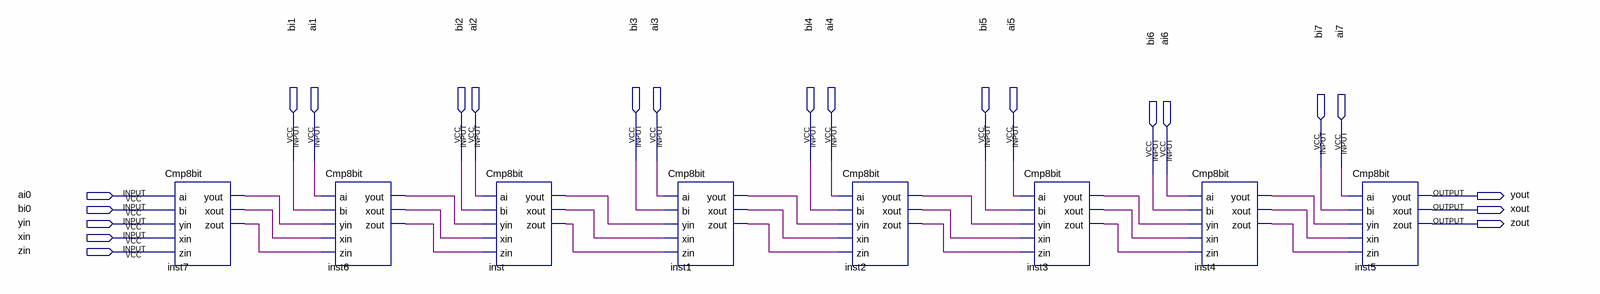
[diagram p0: schematic sheet]
// Quartus schematic cmpbit_8.bdf as structural Verilog: 8 symbols, 22 pins
module cmpbit_8 (
  input  bi1,
  input  ai1,
  input  bi2,
  input  ai2,
  input  bi3,
  input  ai3,
  input  bi4,
  input  ai4,
  input  bi5,
  input  ai5,
  input  bi7,
  input  ai7,
  input  bi6,
  input  ai6,
  input  ai0,
  input  bi0,
  input  yin,
  input  xin,
  input  zin,
  output yout,
  output xout,
  output zout
);

  wire inst1_xout, inst1_yout, inst1_zout, inst2_xout, inst2_yout, inst2_zout, inst3_xout, inst3_yout,
       inst3_zout, inst4_xout, inst4_yout, inst4_zout, inst6_xout, inst6_yout, inst6_zout, inst7_xout,
       inst7_yout, inst7_zout, inst_xout, inst_yout, inst_zout;

  Cmp8bit inst7 (
    .ai(ai0), .bi(bi0), .yin(yin), .xin(xin), .zin(zin), .yout(inst7_yout), .xout(inst7_xout),
    .zout(inst7_zout));
  Cmp8bit inst6 (
    .ai(ai1), .bi(bi1), .yin(inst7_yout), .xin(inst7_xout), .zin(inst7_zout), .yout(inst6_yout),
    .xout(inst6_xout), .zout(inst6_zout));
  Cmp8bit inst (
    .ai(ai2), .bi(bi2), .yin(inst6_yout), .xin(inst6_xout), .zin(inst6_zout), .yout(inst_yout),
    .xout(inst_xout), .zout(inst_zout));
  Cmp8bit inst1 (
    .ai(ai3), .bi(bi3), .yin(inst_yout), .xin(inst_xout), .zin(inst_zout), .yout(inst1_yout),
    .xout(inst1_xout), .zout(inst1_zout));
  Cmp8bit inst2 (
    .ai(ai4), .bi(bi4), .yin(inst1_yout), .xin(inst1_xout), .zin(inst1_zout), .yout(inst2_yout),
    .xout(inst2_xout), .zout(inst2_zout));
  Cmp8bit inst3 (
    .ai(ai5), .bi(bi5), .yin(inst2_yout), .xin(inst2_xout), .zin(inst2_zout), .yout(inst3_yout),
    .xout(inst3_xout), .zout(inst3_zout));
  Cmp8bit inst4 (
    .ai(ai6), .bi(bi6), .yin(inst3_yout), .xin(inst3_xout), .zin(inst3_zout), .yout(inst4_yout),
    .xout(inst4_xout), .zout(inst4_zout));
  Cmp8bit inst5 (
    .ai(ai7), .bi(bi7), .yin(inst4_yout), .xin(inst4_xout), .zin(inst4_zout), .yout(yout), .xout(xout),
    .zout(zout));
endmodule
